# Altium project Wolf-lite-FRONT_V2.PrjPcb
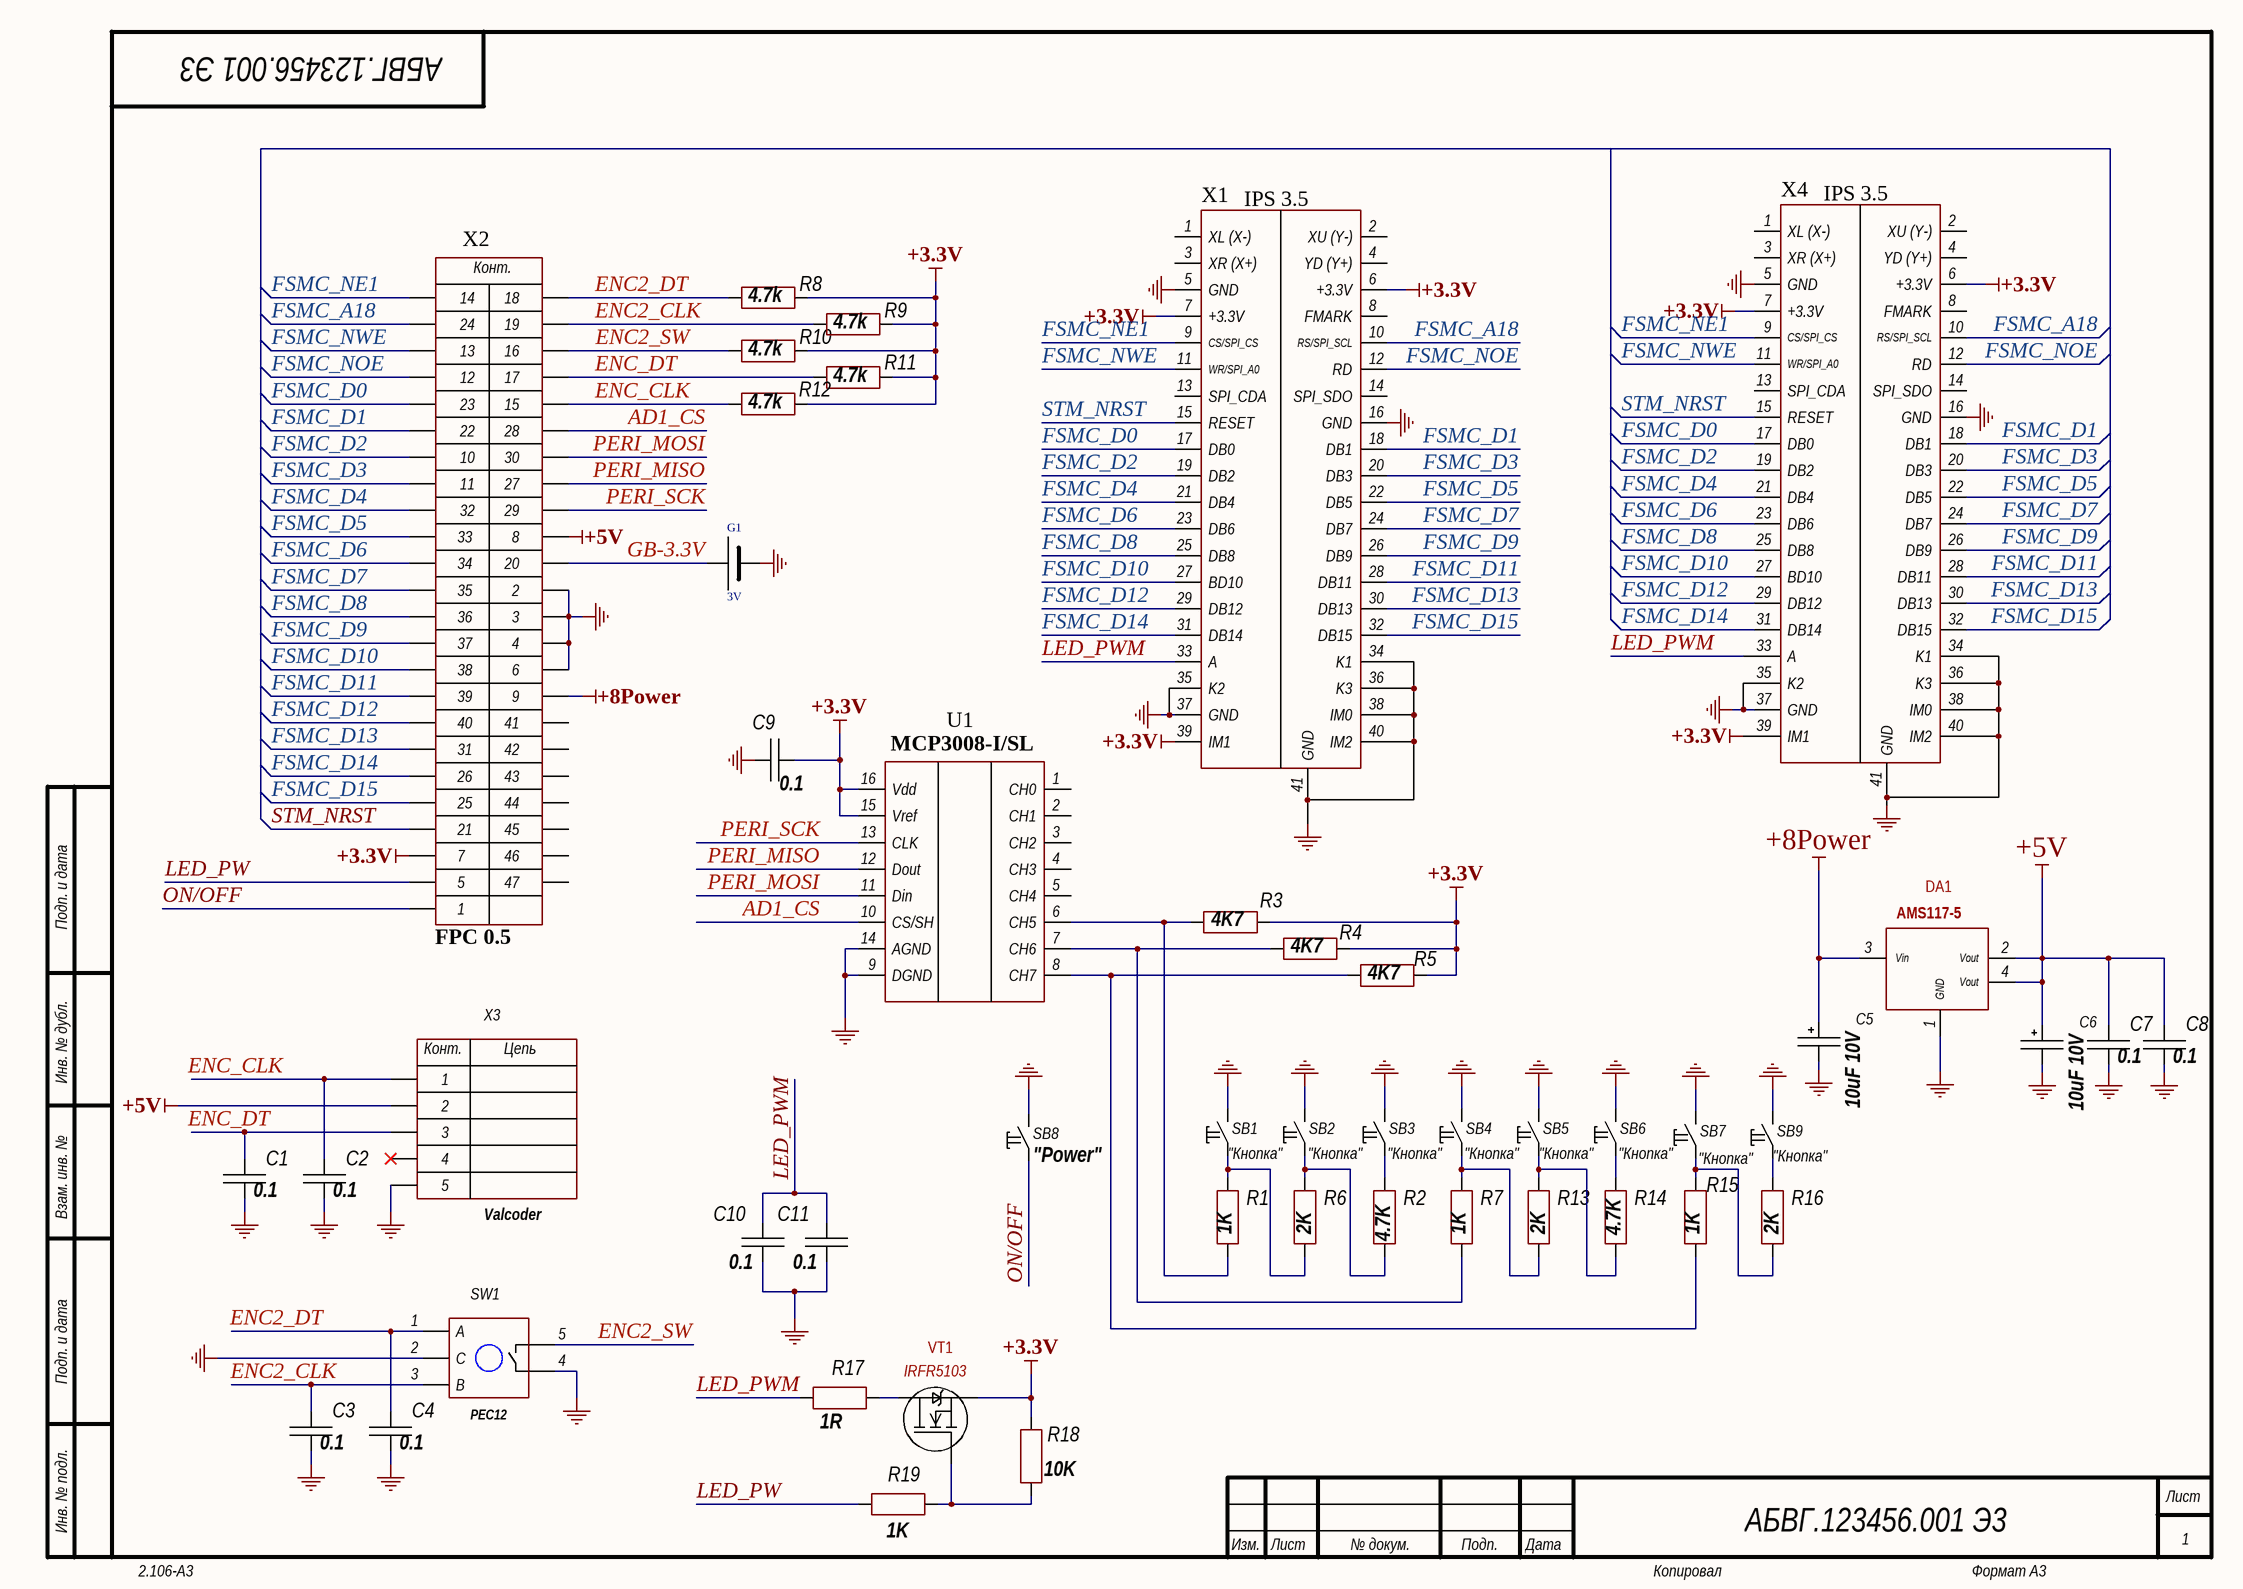
[diagram p0: WL-FRONT.SchDoc]
1 sheet, 48 parts. Net scope: global (net labels, ports and power ports of the same name join across sheets).
Board file: Wl-FRONT.PcbDoc

## Sheet WL-FRONT.SchDoc
size 420 x 297 mm; Address1: Address1; Address2: Address2; Address3: Address3; Address4: Address4; DocumentNumber: АБВГ.123456.001 Э3; SheetNumber: 1; Scale: 1:1; DocumentType: Схема электрическая принципиальная; FirstReferrence: АБВГ.123456.001

### Parts
C1  0.1  [CH0805C]
C2  0.1  [CH0805C]
C3  0.1  [CH0805C]
C4  0.1  [CH0805C]
C5  10uF 10V  [TANTAL_B]
C6  10uF 10V  [TANTAL_B]
C7  0.1  [CH0805C]
C8  0.1  [CH0805C]
C9  0.1  [CH0805C]
C10  0.1  [CH0805C]
C11  0.1  [CH0805C]
DA1  AMS117-5  [SOT223]
G1  3V  [BAT: CH224-2032]
R1  1K  [CH0805R]
R2  4.7K  [CH0805R]
R3  4K7  [CH0805R]
R4  4K7  [CH0805R]
R5  4K7  [CH0805R]
R6  2K  [CH0805R]
R7  1K  [CH0805R]
R8  4.7k  [CH0805R]
R9  4.7k  [CH0805R]
R10  4.7k  [CH0805R]
R11  4.7k  [CH0805R]
R12  4.7k  [CH0805R]
R13  2K  [CH0805R]
R14  4.7K  [CH0805R]
R15  1K  [CH0805R]
R16  2K  [CH0805R]
R17  1R  [CH0805R]
R18  10K  [CH0805R]
R19  1K  [CH0805R]
SB1  "Кнопка"  [BUT: 5X5]
SB2  "Кнопка"  [BUT: 5X5]
SB3  "Кнопка"  [BUT: 5X5]
SB4  "Кнопка"  [BUT: 5X5]
SB5  "Кнопка"  [BUT: 5X5]
SB6  "Кнопка"  [BUT: 5X5]
SB7  "Кнопка"  [BUT: 5X5]
SB8  "Power"  [BUT: 5X5]
SB9  "Кнопка"  [BUT: 5X5]
SW1  PEC12  [Valkoder-m2]
U1  MCP3008-I/SL  [16-SOIC]
VT1  IRFR5103  [SOT23_132]
X1  IPS 3.5  [FPC-40P 0.5mm]
X2  FPC 0.5  [CON: PBD2x20]
X3  Valcoder  [CON: PLS-5]
X4  IPS 3.5  [IPS 3.5 ILI9481]

### Nets
+3.3V: C9.2 R3.2 R4.2 R5.2 R8.1 R9.1 R10.1 R11.1 R12.1 R18.2 U1.15(Vref) U1.16(Vdd) VT1.2(I) X1.6(+3.3V) X1.7(+3.3V) X1.39(IM1) X2.7 X4.6(+3.3V) X4.7(+3.3V) X4.39(IM1)
+5V: C6.1 C7.1 C8.1 DA1.2(Vout) DA1.4(Vout) X2.8 X3.2
+8Power: C5.1 DA1.3(Vin) X2.9
GND: C1.2 C2.2 C3.2 C4.2 C5.2 C6.2 C7.2 C8.2 C9.1 C10.2 C11.2 DA1.1(GND) G1.2 SB1.2 SB2.2 SB3.2 SB4.2 SB5.2 SB6.2 SB7.2 SB8.2 SB9.2 SW1.2(C) SW1.4 U1.9(DGND) U1.14(AGND) X1.5(GND) X1.16(GND) X1.34(K1) X1.35(K2) X1.36(K3) X1.37(GND) X1.38(IM0) X1.40(IM2) X1.41(GND) X2.2 X2.3 X2.4 X2.6 X3.5 X4.5(GND) X4.16(GND) X4.34(K1) X4.35(K2) X4.36(K3) X4.37(GND) X4.38(IM0) X4.40(IM2) X4.41(GND)
AD1_CS: U1.10(CS/SH) X2.28
ENC2_CLK: C3.1 R9.2 SW1.3(B) X2.19
ENC2_DT: C4.1 R8.2 SW1.1(A) X2.18
ENC2_SW: R10.2 SW1.5 X2.16
ENC_CLK: C2.1 R12.2 X2.15 X3.1
ENC_DT: C1.1 R11.2 X2.17 X3.3
FSMC_A18: X1.10(RS/SPI_SCL) X2.24 X4.10(RS/SPI_SCL)
FSMC_D0: X1.17(DB0) X2.23 X4.17(DB0)
FSMC_D1: X1.18(DB1) X2.22 X4.18(DB1)
FSMC_D2: X1.19(DB2) X2.10 X4.19(DB2)
FSMC_D3: X1.20(DB3) X2.11 X4.20(DB3)
FSMC_D4: X1.21(DB4) X2.32 X4.21(DB4)
FSMC_D5: X1.22(DB5) X2.33 X4.22(DB5)
FSMC_D6: X1.23(DB6) X2.34 X4.23(DB6)
FSMC_D7: X1.24(DB7) X2.35 X4.24(DB7)
FSMC_D8: X1.25(DB8) X2.36 X4.25(DB8)
FSMC_D9: X1.26(DB9) X2.37 X4.26(DB9)
FSMC_D10: X1.27(BD10) X2.38 X4.27(BD10)
FSMC_D11: X1.28(DB11) X2.39 X4.28(DB11)
FSMC_D12: X1.29(DB12) X2.40 X4.29(DB12)
FSMC_D13: X1.30(DB13) X2.31 X4.30(DB13)
FSMC_D14: X1.31(DB14) X2.26 X4.31(DB14)
FSMC_D15: X1.32(DB15) X2.25 X4.32(DB15)
FSMC_NE1: X1.9(CS/SPI_CS) X2.14 X4.9(CS/SPI_CS)
FSMC_NOE: X1.12(RD) X2.12 X4.12(RD)
FSMC_NWE: X1.11(WR/SPI_A0) X2.13 X4.11(WR/SPI_A0)
GB-3.3V: G1.1 X2.20
LED_PW: R19.2 X2.5
LED_PWM: C10.1 C11.1 R17.2 X1.33(A) X4.33(A)
ON/OFF: SB8.1 X2.1
PERI_MISO: U1.12(Dout) X2.27
PERI_MOSI: U1.11(Din) X2.30
PERI_SCK: U1.13(CLK) X2.29
STM_NRST: X1.15(RESET) X2.21 X4.15(RESET)
NetR1_1: R1.1 R3.1 U1.6(CH5)
NetR1_2: R1.2 R6.1 SB1.1
NetR2_1: R2.1 R6.2 SB2.1
NetR2_2: R2.2 SB3.1
NetR4_1: R4.1 R7.1 U1.7(CH6)
NetR5_1: R5.1 R15.1 U1.8(CH7)
NetR7_2: R7.2 R13.1 SB4.1
NetR13_2: R13.2 R14.1 SB5.1
NetR14_2: R14.2 SB6.1
NetR15_2: R15.2 R16.1 SB7.1
NetR16_2: R16.2 SB9.1
NetR17_1: R17.1 VT1.3(Сток(Drain))
NetR18_1: R18.1 R19.1 VT1.1(Затвор(Gate))

Not connected (* = marked no-connect by the designer): U1 1(CH0) 2(CH1) 3(CH2) 4(CH3) 5(CH4); X1 1(XL_(X-)) 2(XU_(Y-)) 3(XR_(X+)) 4(YD_(Y+)) 8(FMARK) 13(SPI_CDA) 14(SPI_SDO); X2 41 42 43 44 45 46 47; X3 4*; X4 1(XL_(X-)) 2(XU_(Y-)) 3(XR_(X+)) 4(YD_(Y+)) 8(FMARK) 13(SPI_CDA) 14(SPI_SDO)

### Notes on the sheet
- Подп. и дата
- Инв. № дубл.
- Взам. инв. №
- Инв. № подл.
- Изм.
- Лист
- № докум.
- Подп.
- Дата
- 2.106-A3
- Копировал
- Формат А3
- (in symbol 5-Connector) Конт.; Цепь
- (in symbol FPC-45-0.5) Конт.

### Library data of the parts
C1-C4 C7-C11 = Capacitor: Manufacturer: *; Model: *; HelpURL: *; ComponentKind: *; Value: *
C5 C6 = TantalCap: Manufacturer: *; Model: *; HelpURL: *; ComponentKind: *; Value: *
DA1 = AMS117
G1 = POWER_BAT
R1-R19 = Resistor: Manufacturer: *; Model: *; HelpURL: *; ComponentKind: *; Value: *
SB1-SB9 = Tactile switches: 6x6 mm; Manufacturer: *; Model: *; HelpURL: *; ComponentKind: *
SW1 = PEC12: Encoder; Model: *; Manufacturer: *; HelpURL: *; ComponentKind: *
VT1 = N-KANAL
X1 X4 = LCD-IPS 3.5
X2 = FPC-45-0.5: System: Connector
X3 = 5-Connector: Model: *; Manufacturer: *; HelpURL: *; ComponentKind: *